# Altium schematic sheet EXS82_USB.SchDoc
size 594 x 420 mm; SheetNumber: 2; PageSetup: Record=PageOptions|CenterHorizontal=False|CenterVertical=False|PrintScale=0.43|XCorrection=0.00|YCorrection=0.00|PrintKind=1|BorderSize=5000000|LeftOffset=0|BottomOffset=0|Orientation=2|PaperLength=5940|PaperWidth=4200|Scale=100|PaperSource=7|PrintQuality=-4|MediaType=1|DitherType=10|PaperKind=Personal. 1: 215,9 x 279,4 mm|PrintScaleMode=0
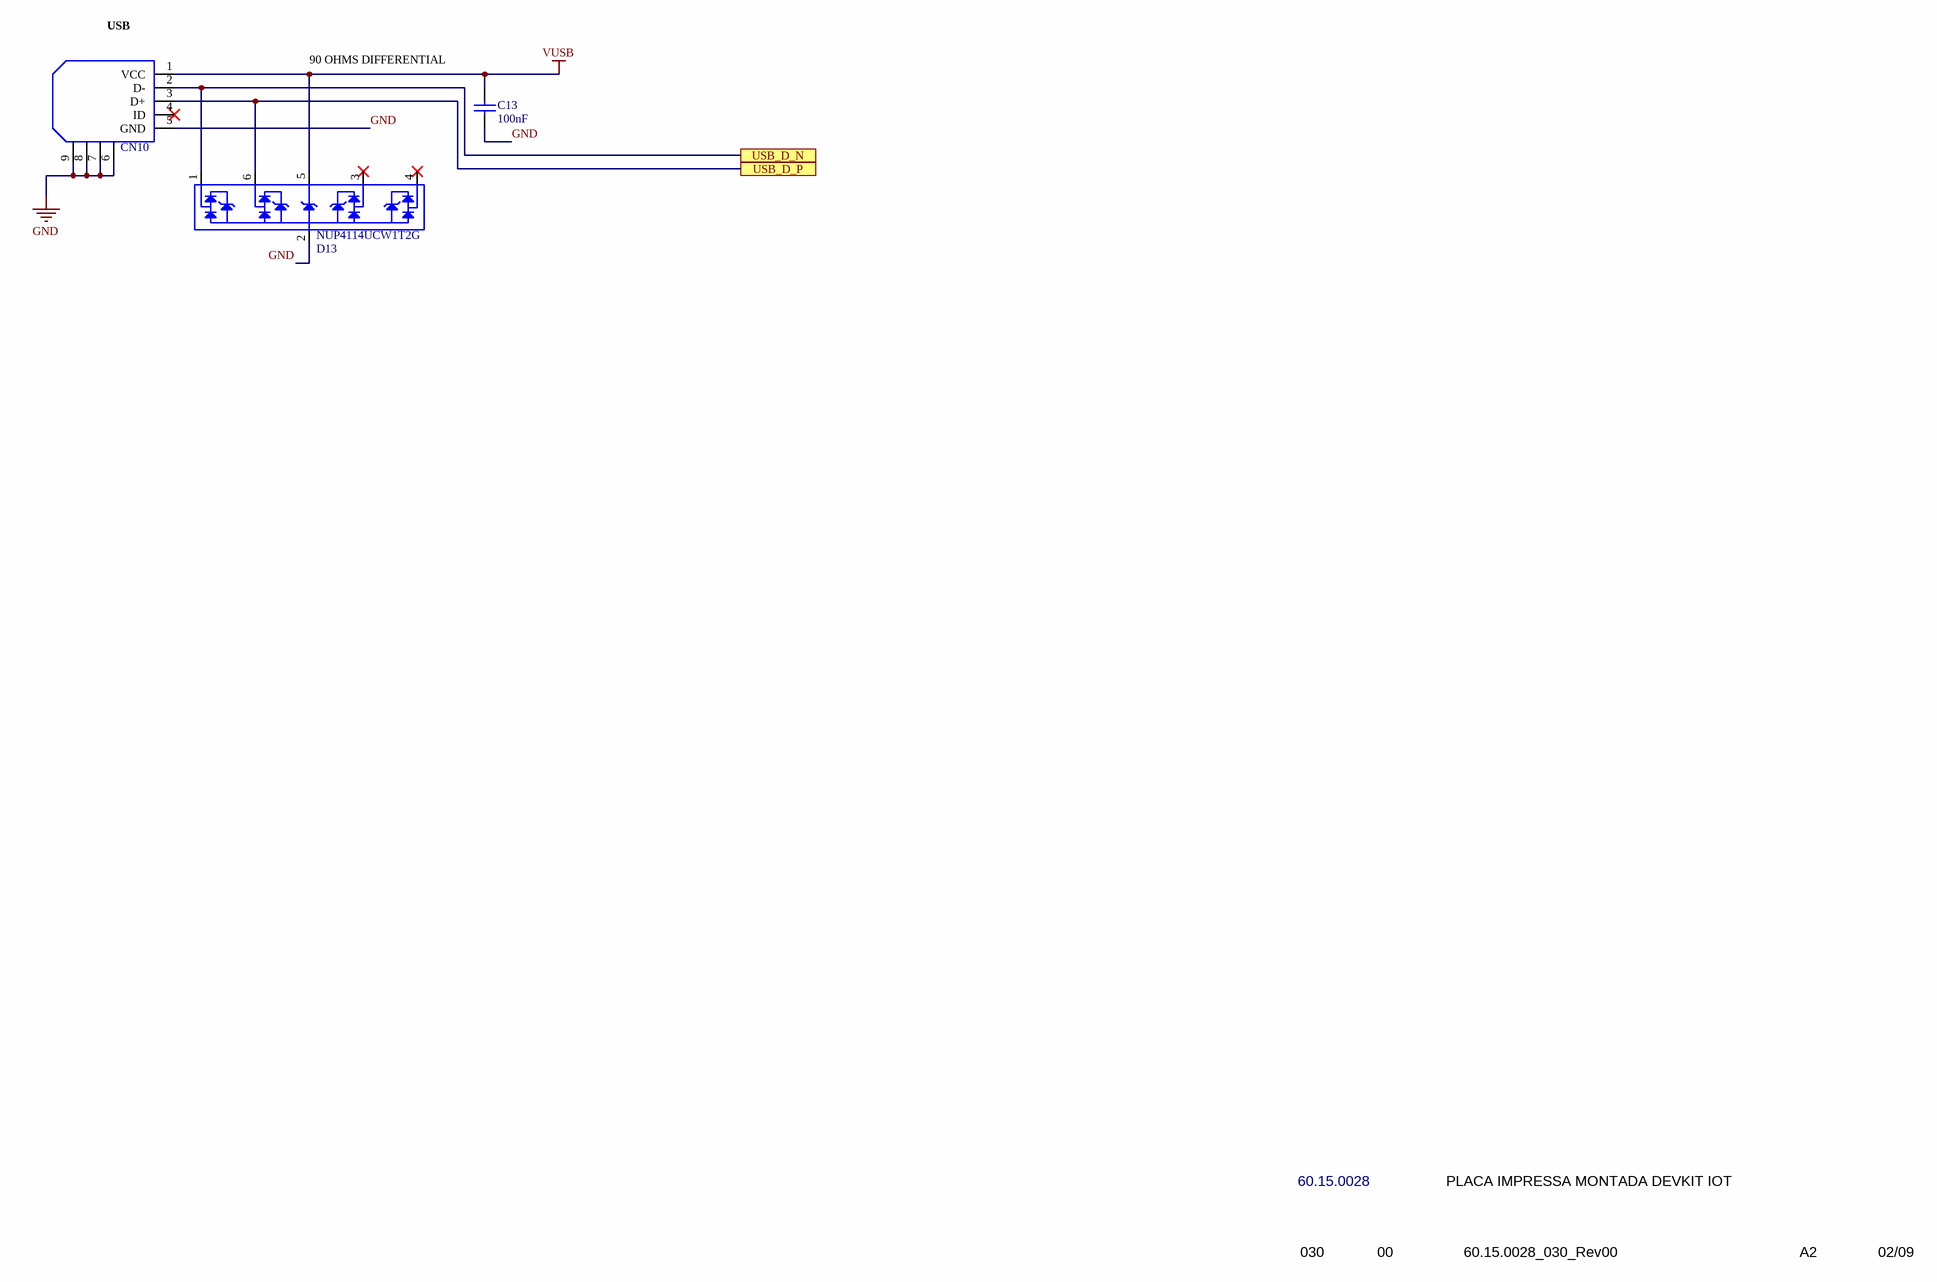
[diagram p0: EXS82_USB.SchDoc]

## Parts
C13  16.23.0803  [16.23.0803]  (value not drawn)
CN10  28.14.0512  [28.14.0512]  (value not drawn)
D13  32.27.0043  [32.27.0043]  (value not drawn)

## Ports
USB_D_N, USB_D_P

## Nets
GND: C13.1 CN10.5(GND) CN10.6(SHIELD) CN10.7(SHIELD) CN10.8(SHIELD) CN10.9(SHIELD) D13.2
VUSB: C13.2 CN10.1(VCC) D13.5
USB_D_N: CN10.2(D-) D13.1 ; port USB_D_N
USB_D_P: CN10.3(D+) D13.6 ; port USB_D_P

Not connected (* = marked no-connect by the designer): CN10 4(ID)*; D13 3* 4*

## Notes on the sheet
- (near CN10) USB
- 90 OHMS DIFFERENTIAL
- 60.15.0028
- PLACA IMPRESSA MONTADA DEVKIT IOT
- 030
- 00
- 60.15.0028_030_Rev00
- A2
- 02/09
- 1
- 2
- 3
- 4
- 5
- 6
- 7
- 8
- A
- B
- C
- D
- E
- F
- G
- H
- DOCUMENTO DE ENGENHARIA DE PRODUTO
- DOCUMENT OF PRODUCT ENGINEERING
- CÓDIGO / CODE
- DESCRIÇÃO / DESCRIPTION
- DOC
- REV
- ARQUIVO / FILE
- FORM./SIZE
- FOLHA / PAGE
- (in symbol 16.23.0803) 100nF
- (in symbol 32.27.0043) NUP4114UCW1T2G

## Library data of the parts
C13 = 16.23.0803: CAPACITOR CERAMICO 100nF 16V 10%% X5R SMD 0201
CN10 = 28.14.0512: CONN USB MICRO B RECPT SMT R/A; Value: 10118192-0001LF
D13 = 32.27.0043: DIODO SUPRESSOR 5.5V 10V SC88